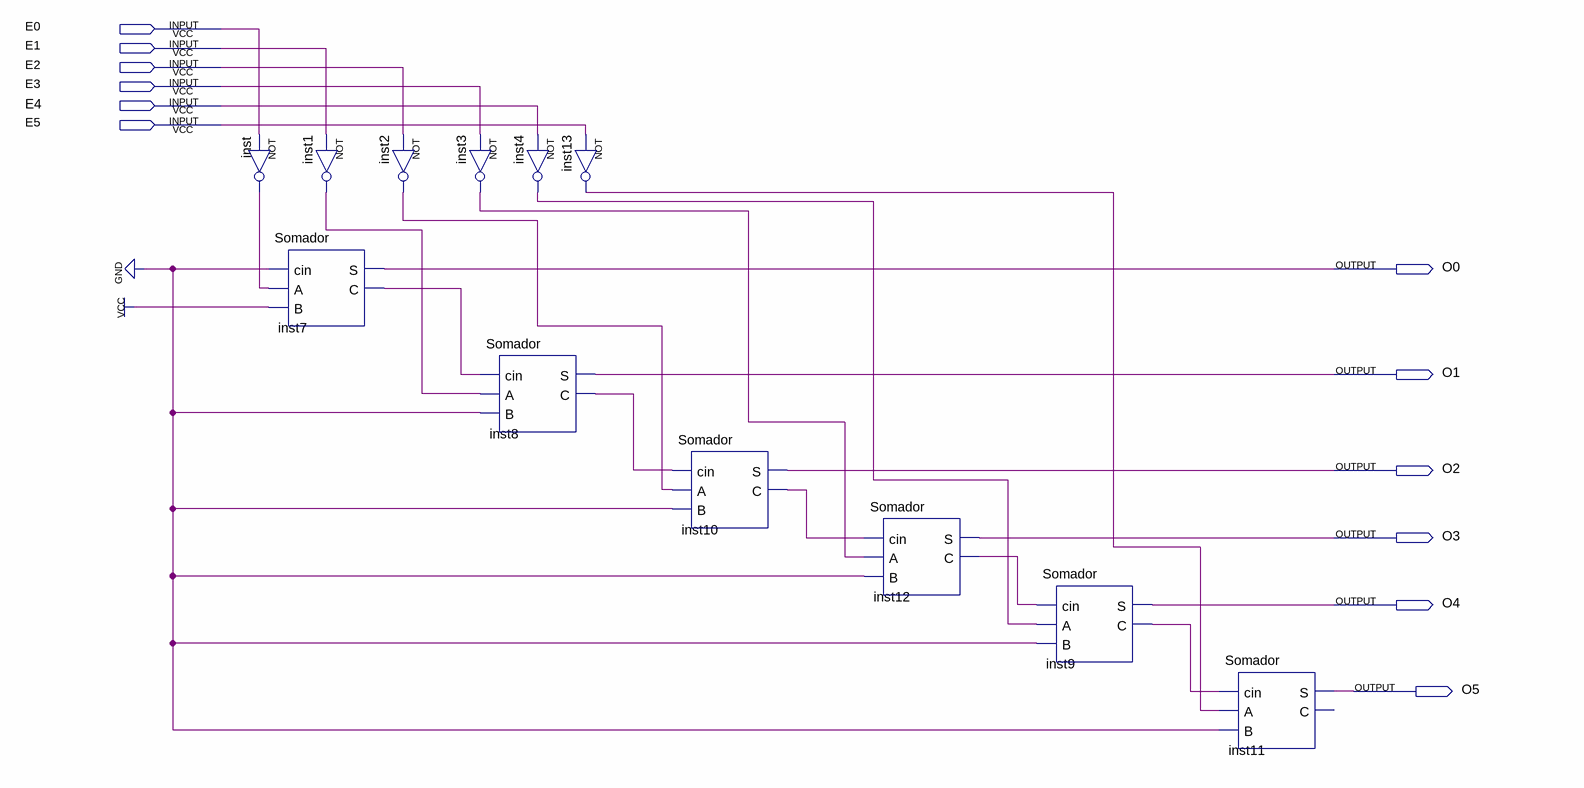
[diagram p0: schematic sheet]
// Quartus schematic ComplementoDois.bdf as structural Verilog: 12 symbols, 12 pins
module ComplementoDois (
  input  E0,
  input  E1,
  input  E2,
  input  E3,
  input  E4,
  input  E5,
  output O0,
  output O1,
  output O2,
  output O3,
  output O4,
  output O5
);

  wire inst1_out, inst2_out, inst3_out, inst4_out, inst7_c, inst8_c, inst9_c, inst10_c, inst12_c, inst13_out,
       inst_out;

  not inst (inst_out, E0);
  not inst1 (inst1_out, E1);
  Somador inst7 (.cin(1'b0), .A(inst_out), .B(1'b1), .S(O0), .C(inst7_c));
  not inst2 (inst2_out, E2);
  not inst3 (inst3_out, E3);
  Somador inst8 (.cin(inst7_c), .A(inst1_out), .B(1'b0), .S(O1), .C(inst8_c));
  not inst4 (inst4_out, E4);
  not inst13 (inst13_out, E5);
  Somador inst10 (.cin(inst8_c), .A(inst2_out), .B(1'b0), .S(O2), .C(inst10_c));
  Somador inst12 (.cin(inst10_c), .A(inst3_out), .B(1'b0), .S(O3), .C(inst12_c));
  Somador inst9 (.cin(inst12_c), .A(inst4_out), .B(1'b0), .S(O4), .C(inst9_c));
  Somador inst11 (.cin(inst9_c), .A(inst13_out), .B(1'b0), .S(O5));  // open: C
endmodule
